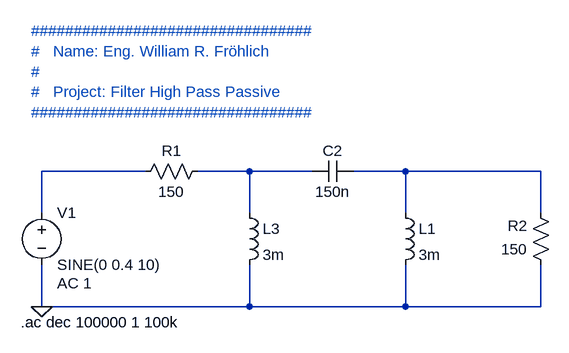
[diagram p0: schematic Filter_High_Pass_Passive.asc]
Filter_High_Pass_Passive.asc, the LTspice schematic file:
Version 4
SHEET 1 880 680
WIRE 16 80 -144 80
WIRE 176 80 96 80
WIRE 272 80 176 80
WIRE 416 80 336 80
WIRE 624 80 416 80
WIRE -144 144 -144 80
WIRE 176 144 176 80
WIRE 416 144 416 80
WIRE 624 144 624 80
WIRE -144 288 -144 224
WIRE 176 288 176 224
WIRE 176 288 -144 288
WIRE 416 288 416 224
WIRE 416 288 176 288
WIRE 624 288 624 224
WIRE 624 288 416 288
FLAG -144 288 0
SYMBOL res 112 64 R90
WINDOW 0 0 56 VBottom 2
WINDOW 3 32 56 VTop 2
SYMATTR InstName R1
SYMATTR Value 150
SYMBOL res 640 240 R180
WINDOW 0 36 76 Left 2
WINDOW 3 36 40 Left 2
SYMATTR InstName R2
SYMATTR Value 150
SYMBOL voltage -144 128 R0
WINDOW 123 24 124 Left 2
WINDOW 39 0 0 Left 2
SYMATTR Value2 AC 1
SYMATTR InstName V1
SYMATTR Value SINE(0 0.4 10)
SYMBOL ind 400 128 R0
SYMATTR InstName L1
SYMATTR Value 3m
SYMBOL ind 160 128 R0
SYMATTR InstName L3
SYMATTR Value 3m
SYMBOL cap 336 64 R90
WINDOW 0 0 32 VBottom 2
WINDOW 3 32 32 VTop 2
SYMATTR InstName C2
SYMATTR Value 150n
TEXT -176 312 Left 2 !.ac dec 100000 1 100k
TEXT -160 -136 Left 2 ;#################################\n#   Name: Eng. William R. Fröhlich\n#\n#   Project: Filter High Pass Passive\n#################################

The netlist it stands for:
* Filter_High_Pass_Passive.asc
R1 N002 N001 150
R2 0 N003 150
V1 N001 0 SINE(0 0.4 10) AC 1
L1 N003 0 3m
L3 N002 0 3m
C2 N003 N002 150n
.ac dec 100000 1 100k
* #################################
* #   Name: Eng. William R. Fröhlich
* #
* #   Project: Filter High Pass Passive
* #################################
.backanno
.end